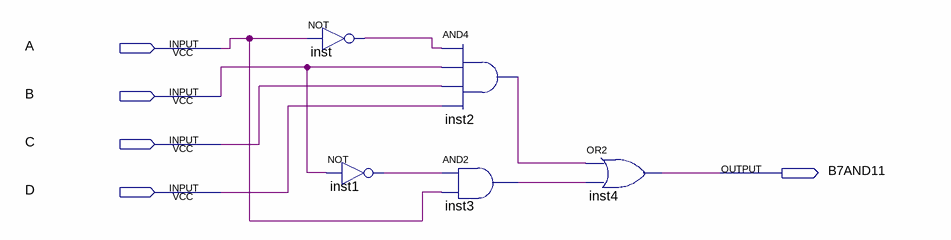
[diagram p0: schematic sheet]
// Quartus schematic B711.bdf as structural Verilog: 5 symbols, 5 pins
module B711 (
  input  A,
  input  B,
  input  C,
  input  D,
  output B7AND11
);

  wire inst1_out, inst2_out, inst3_out, inst_out;

  not inst (inst_out, A);
  not inst1 (inst1_out, B);
  and inst2 (inst2_out, inst_out, B, C, D);
  and inst3 (inst3_out, inst1_out, A);
  or inst4 (B7AND11, inst2_out, inst3_out);
endmodule
